# EAGLE design LCD_to_VGA_Modul (EAGLE 7.7.0)
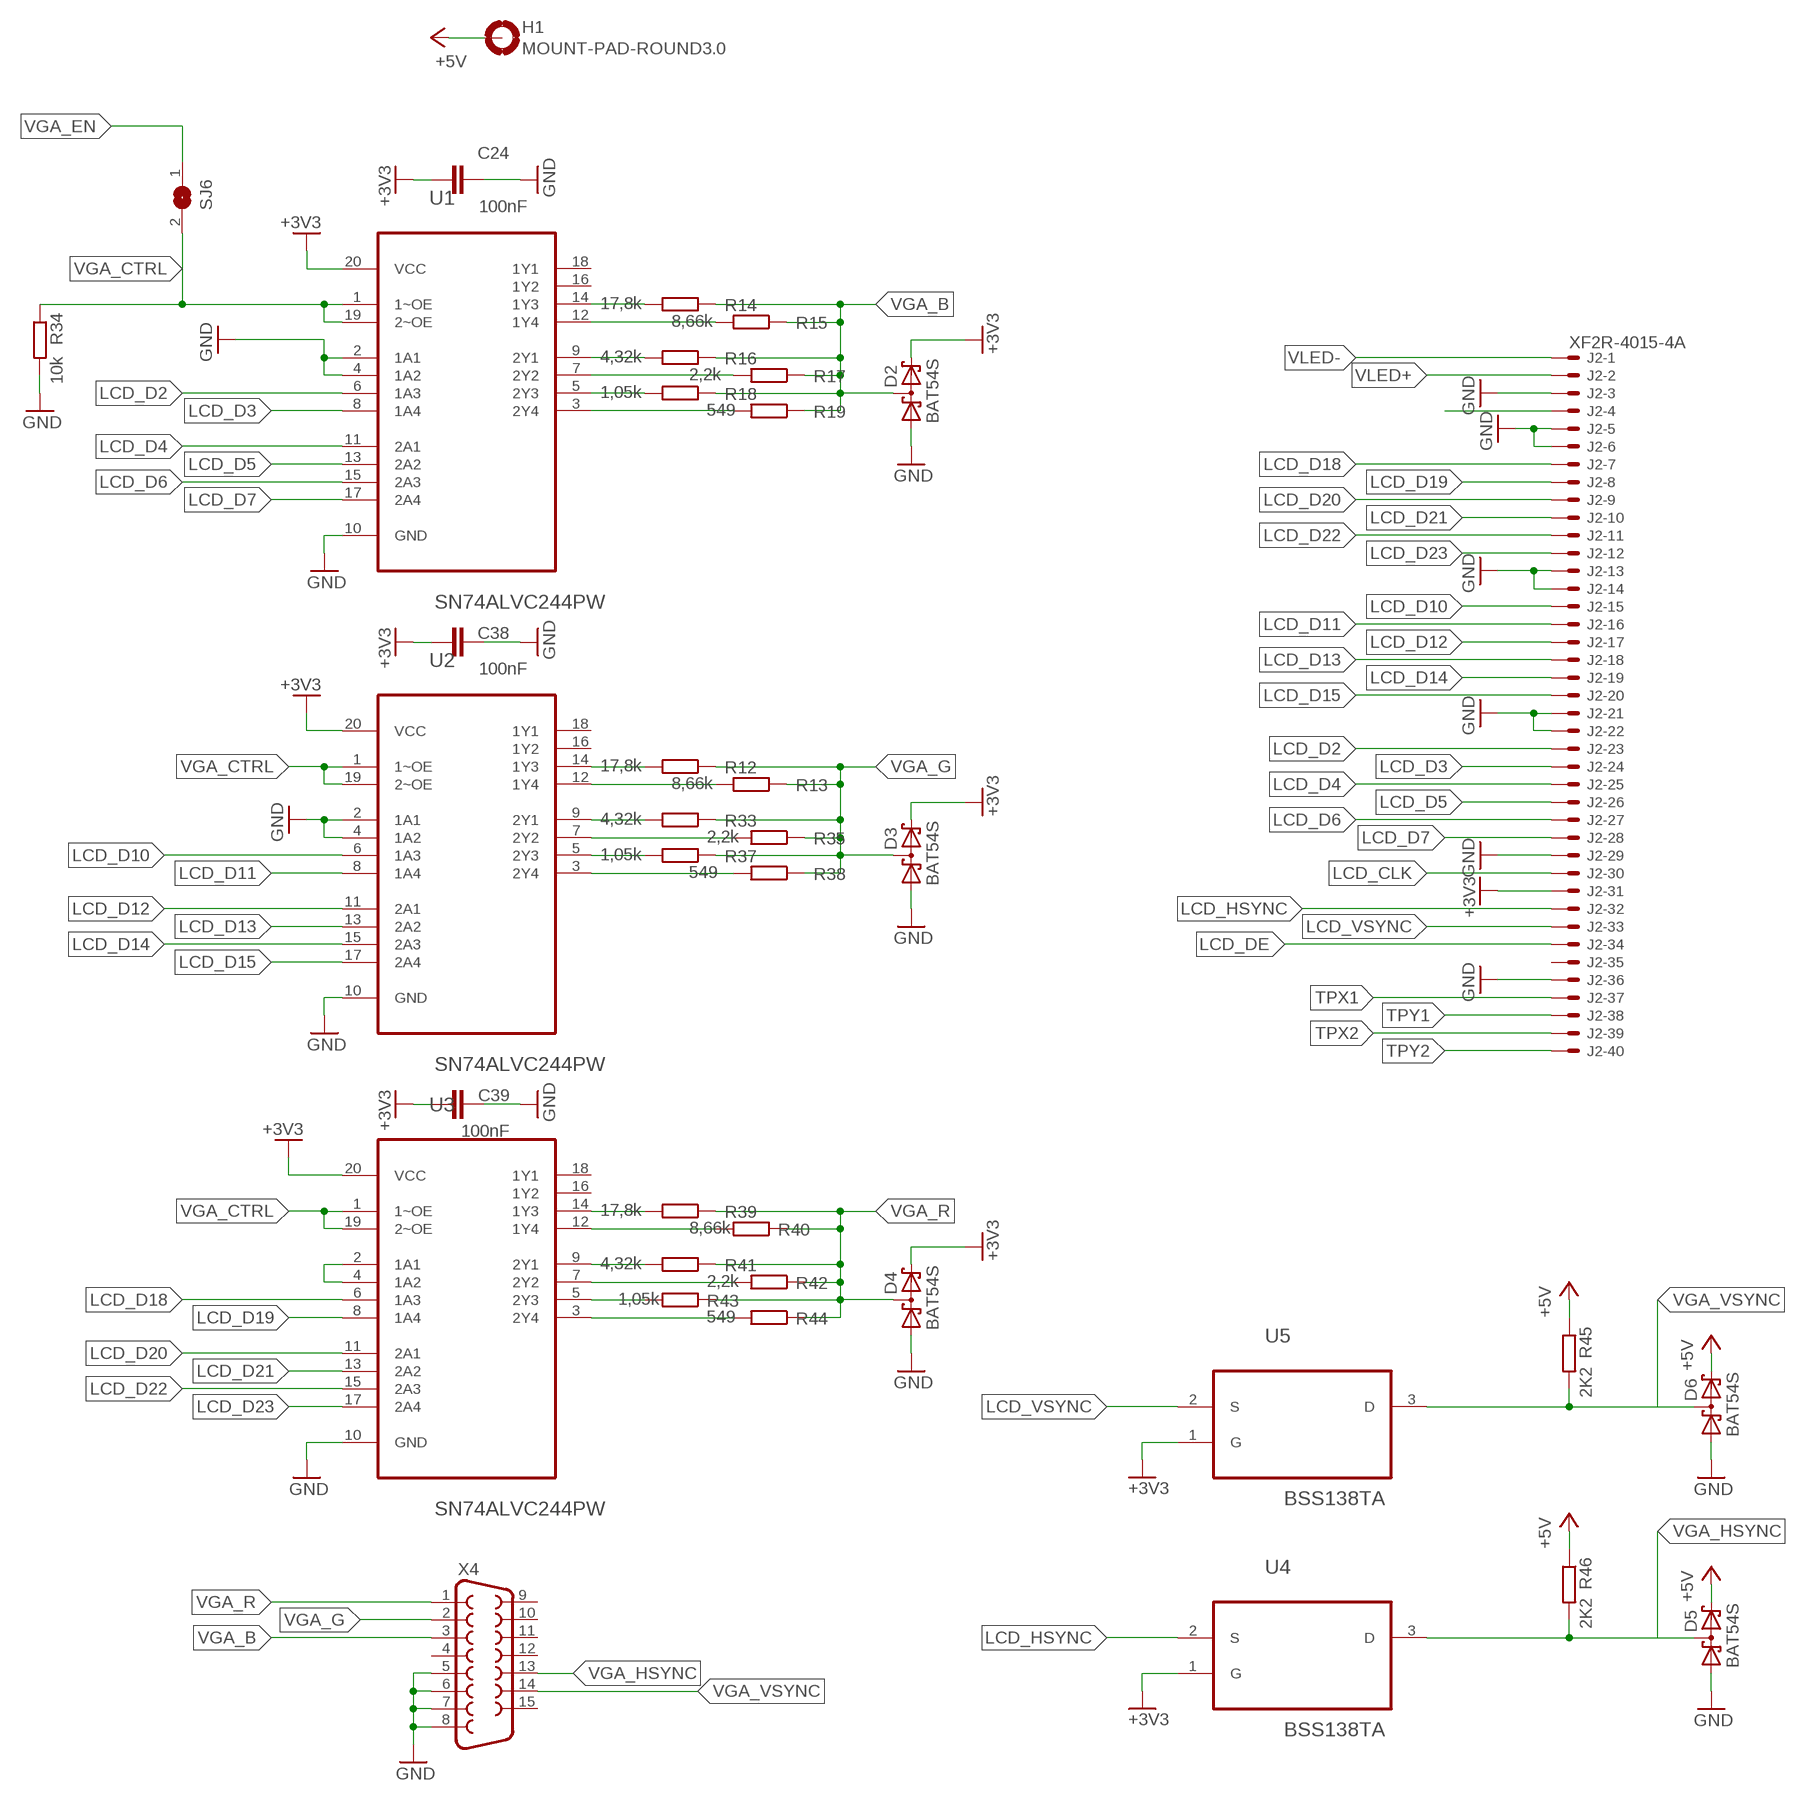
[diagram p0: schematic, sheet 1]

## Parts
C24  100nF  C-EUC0805  [C0805]
C38  100nF  C-EUC0805  [C0805]
C39  100nF  C-EUC0805  [C0805]
D2  BAT54S  [SOT23]
D3  BAT54S  [SOT23]
D4  BAT54S  [SOT23]
D5  BAT54S  [SOT23]
D6  BAT54S  [SOT23]
H1  MOUNT-PAD-ROUND3.0  [3,0-PAD]
J2  XF2R-4015-4A  [XF2R-4015-4A]
R12  17,8k  R-EU_R0805  [R0805]
R13  8,66k  R-EU_R0805  [R0805]
R14  17,8k  R-EU_R0805  [R0805]
R15  8,66k  R-EU_R0805  [R0805]
R16  4,32k  R-EU_R0805  [R0805]
R17  2,2k  R-EU_R0805  [R0805]
R18  1,05k  R-EU_R0805  [R0805]
R19  549  R-EU_R0805  [R0805]
R33  4,32k  R-EU_R0805  [R0805]
R34  10k  R-EU_R0805  [R0805]
R35  2,2k  R-EU_R0805  [R0805]
R37  1,05k  R-EU_R0805  [R0805]
R38  549  R-EU_R0805  [R0805]
R39  17,8k  R-EU_R0805  [R0805]
R40  8,66k  R-EU_R0805  [R0805]
R41  4,32k  R-EU_R0805  [R0805]
R42  2,2k  R-EU_R0805  [R0805]
R43  1,05k  R-EU_R0805  [R0805]
R44  549  R-EU_R0805  [R0805]
R45  2K2  R-EU_R0805  [R0805]
R46  2K2  R-EU_R0805  [R0805]
SJ6  SJ  [SJ]
U1  SN74ALVC244PW  [SOP65P640X120-20N]
U2  SN74ALVC244PW  [SOP65P640X120-20N]
U3  SN74ALVC244PW  [SOP65P640X120-20N]
U4  BSS138TA  [SOT95P240X110-3N]
U5  BSS138TA  [SOT95P240X110-3N]
X4  F15H  [F15H]

## Nets
+3V3: C24.2 C38.2 C39.2 D2.2(K2) D3.2(K2) D4.2(K2) J2.31 U1.20(VCC) U2.20(VCC) U3.20(VCC) U4.1(G) U5.1(G)
+5V: D5.2(K2) D6.2(K2) H1.B3,0(MOUNT) R45.1 R46.1
GND: C24.1 C38.1 C39.1 D2.1(A1) D3.1(A1) D4.1(A1) D5.1(A1) D6.1(A1) J2.3 J2.5 J2.6 J2.13 J2.14 J2.21 J2.22 J2.29 J2.36 R34.2 U1.2(1A1) U1.4(1A2) U1.10(GND) U2.2(1A1) U2.4(1A2) U2.10(GND) U3.10(GND) X4.5 X4.6 X4.7 X4.8
LCD_CLK: J2.30
LCD_D2: J2.23 U1.6(1A3)
LCD_D3: J2.24 U1.8(1A4)
LCD_D4: J2.25 U1.11(2A1)
LCD_D5: J2.26 U1.13(2A2)
LCD_D6: J2.27 U1.15(2A3)
LCD_D7: J2.28 U1.17(2A4)
LCD_D10: J2.15 U2.6(1A3)
LCD_D11: J2.16 U2.8(1A4)
LCD_D12: J2.17 U2.11(2A1)
LCD_D13: J2.18 U2.13(2A2)
LCD_D14: J2.19 U2.15(2A3)
LCD_D15: J2.20 U2.17(2A4)
LCD_D18: J2.7 U3.6(1A3)
LCD_D19: J2.8 U3.8(1A4)
LCD_D20: J2.9 U3.11(2A1)
LCD_D21: J2.10 U3.13(2A2)
LCD_D22: J2.11 U3.15(2A3)
LCD_D23: J2.12 U3.17(2A4)
LCD_DE: J2.34
LCD_HSYNC: J2.32 U4.2(S)
LCD_VSYNC: J2.33 U5.2(S)
N$1: J2.4
N$2: R12.2 U2.14(1Y3)
N$7: R13.2 U2.12(1Y4)
N$10: R14.2 U1.14(1Y3)
N$11: R15.2 U1.12(1Y4)
N$12: R16.2 U1.9(2Y1)
N$13: R17.2 U1.7(2Y2)
N$14: R18.2 U1.5(2Y3)
N$15: R19.2 U1.3(2Y4)
N$16: U3.2(1A1) U3.4(1A2)
N$26: R33.2 U2.9(2Y1)
N$27: R35.2 U2.7(2Y2)
N$28: R37.2 U2.5(2Y3)
N$29: R38.2 U2.3(2Y4)
N$30: R44.2 U3.3(2Y4)
N$31: R43.2 U3.5(2Y3)
N$32: R42.2 U3.7(2Y2)
N$33: R41.2 U3.9(2Y1)
N$34: R40.2 U3.12(1Y4)
N$35: R39.2 U3.14(1Y3)
TPX1: J2.37
TPX2: J2.39
TPY1: J2.38
TPY2: J2.40
VGA_B: D2.3(K1A2) R14.1 R15.1 R16.1 R17.1 R18.1 R19.1 X4.3
VGA_CTRL: R34.1 SJ6.2 U1.1(1~OE) U1.19(2~OE) U2.1(1~OE) U2.19(2~OE) U3.1(1~OE) U3.19(2~OE)
VGA_EN: SJ6.1
VGA_G: D3.3(K1A2) R12.1 R13.1 R33.1 R35.1 R37.1 R38.1 X4.2
VGA_HSYNC: D5.3(K1A2) R46.2 U4.3(D) X4.13
VGA_R: D4.3(K1A2) R39.1 R40.1 R41.1 R42.1 R43.1 R44.1 X4.1
VGA_VSYNC: D6.3(K1A2) R45.2 U5.3(D) X4.14
VLED+: J2.2
VLED-: J2.1
Unconnected: J2.35 U1.16(1Y2) U1.18(1Y1) U2.16(1Y2) U2.18(1Y1) U3.16(1Y2) U3.18(1Y1) X4.4 X4.9 X4.10 X4.11 X4.12 X4.15

## Library data of the parts
C24 C38 C39 = rcl:C-EU: CAPACITOR, European symbol
D2-D6 = nxp_60:BAT54S: Schottky barrier (double) diodes Planar Schottky barrier diodes encapsulated in a SOT23 small plastic SMD package. Single diodes and double diodes with different pinning are available. AAL Eindhoven MK
H1 = holes:MOUNT-PAD-ROUND: MOUNTING PAD, round
J2 = con-omron:XF2*-40?: OMRON FPC Connector Source : http://www.omron.com/ecb/products/pdf/fpc.pdf
R12-R19 R33-R35 R37-R46 = rcl:R-EU_: RESISTOR, European symbol
SJ6 = jumper:SJ: SMD solder JUMPER
U1-U3 = Texas Instruments_By_element14_Batch_1:SN74ALVC244PW: OCTAL BUFFERS/DRIVERS WITH 3-STATE OUTPUTS; MPN: SN74ALVC244PW; OC_FARNELL: 1470750; OC_NEWARK: 36K3549; PACKAGE: TSSOP-20; SUPPLIER: Texas Instruments
U4 U5 = Diodes_Inc_By_element14_Batch_1:BSS138TA: N-CHANNEL ENHANCEMENT MODE MOSFET; MPN: BSS138TA; OC_FARNELL: 1471176; OC_NEWARK: 61M5072; PACKAGE: SOT-23-3; SUPPLIER: Diodes Inc
X4 = adafruit:F15: SUB-D HDH is also known as a 'right angle VGA' connector

## Net classes
0 default: clearance 0.152 mm

## Board
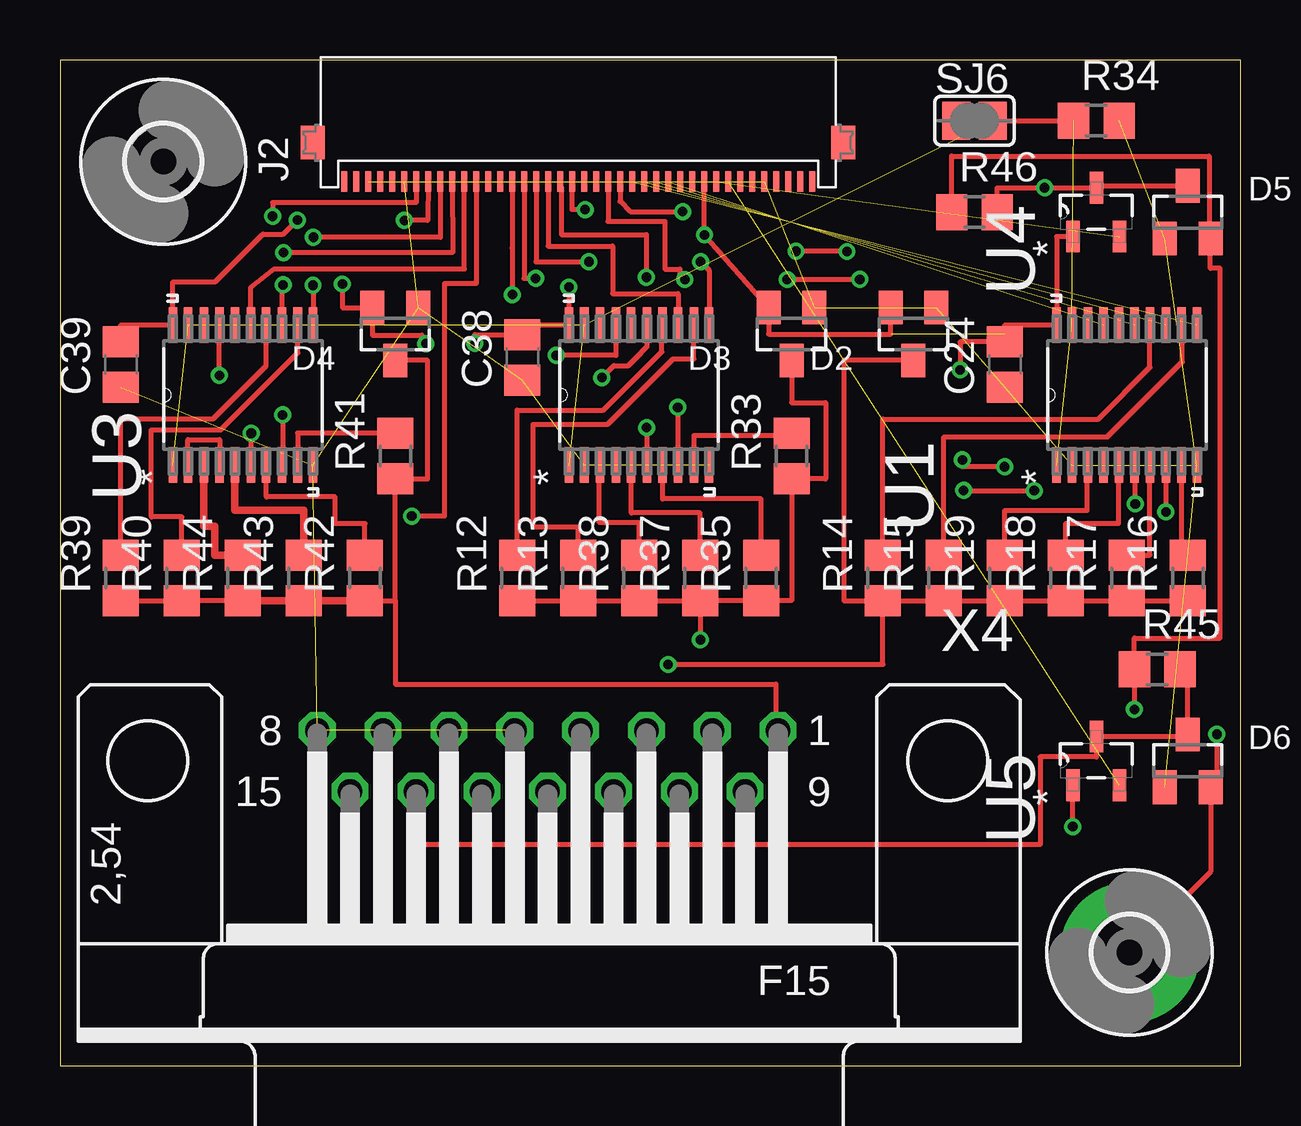
[diagram p1: board, top side]
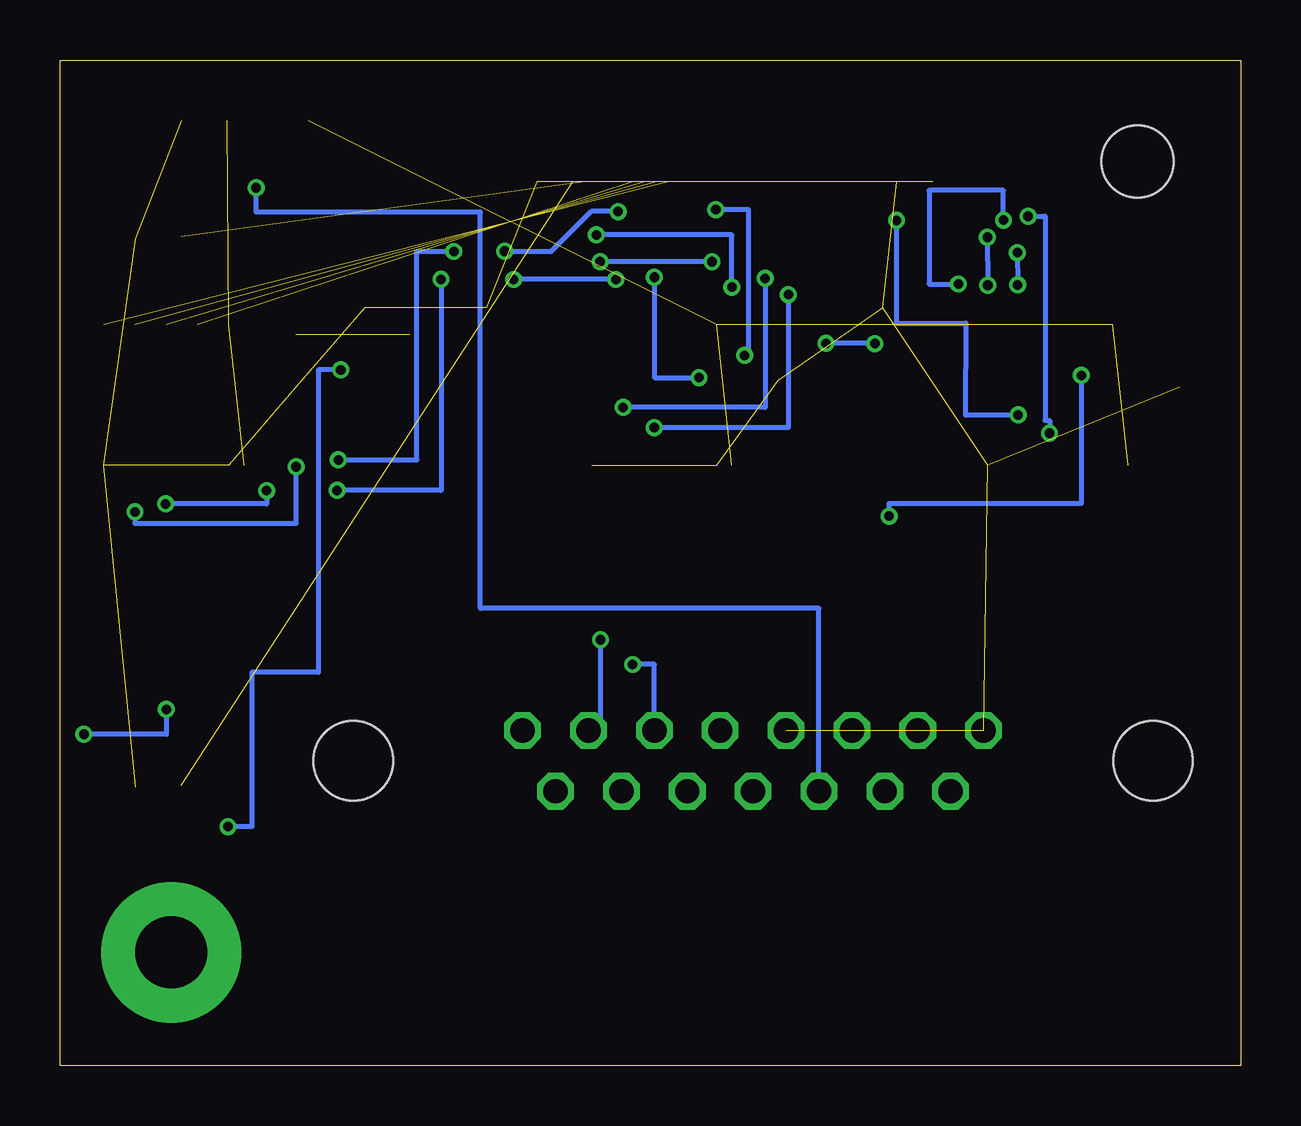
[diagram p2: board, bottom side, seen from below]

Size 49.2 x 41.9 mm. Coordinates in mm from the lower left corner, seen from the top.
Outline: 0,0 49.2,0 49.2,41.9 0,41.9 0,0
Copper layers (1*16): Top 0.035mm / dielectric 1.5mm / Bottom 0.035mm
Design rules "SeeedStudio_2layer_DRU_no_angle_20140221": minimum track width 6mil, minimum drill 12mil, track to track 6mil, track to pad 6mil, pad to pad 6mil, via to via 6mil, smd to smd 0mil, copper to edge 10mil, drill to drill 10mil, minimum pad ring 10mil, minimum via ring 6mil, stop-mask expansion 2mil, vias tented up to drill 100mil, thermal gap 10mil

### Footprints (pad centres in the part's own frame; a part is rotated, then mirrored left to right if it is on the bottom)
C0805 = smd 1.3 x 1.5: 1 -0.95,0; 2 0.95,0
SOT23 = smd 1 x 1.4: 1 -0.95,-1.1; 2 0.95,-1.1; 3 0,1.1
3,0-PAD = drill 3 pad 5.842: B3,0 0,0
XF2R-4015-4A = smd 0.85 x 0.25: 1 -2.54,9.75; 2 -2.54,9.25; 3 -2.54,8.75; 4 -2.54,8.25; 5 -2.54,7.75; 6 -2.54,7.25; 7 -2.54,6.75; 8 -2.54,6.25; 9 -2.54,5.75; 10 -2.54,5.25; 11 -2.54,4.75; 12 -2.54,4.25; 13 -2.54,3.75; 14 -2.54,3.25; 15 -2.54,2.75; 16 -2.54,2.25; 17 -2.54,1.75; 18 -2.54,1.25; 19 -2.54,0.75; 20 -2.54,0.25; 21 -2.54,-0.25; 22 -2.54,-0.75; 23 -2.54,-1.25; 24 -2.54,-1.75; 25 -2.54,-2.25; 26 -2.54,-2.75; 27 -2.54,-3.25; 28 -2.54,-3.75; 29 -2.54,-4.25; 30 -2.54,-4.75; 31 -2.54,-5.25; 32 -2.54,-5.75; 33 -2.54,-6.25; 34 -2.54,-6.75; 35 -2.54,-7.25; 36 -2.54,-7.75; 37 -2.54,-8.25; 38 -2.54,-8.75; 39 -2.54,-9.25; 40 -2.54,-9.75 | smd 1.4 x 1: M1 -0.915,11.05; M2 -0.915,-11.05
R0805 = smd 1.3 x 1.5: 1 -0.95,0; 2 0.95,0
SJ = smd 1.168 x 1.6: 1 -0.762,0; 2 0.762,0
SOP65P640X120-20N = smd 1.473 x 0.356: 1 -2.921,2.921; 2 -2.921,2.286; 3 -2.921,1.626; 4 -2.921,0.965; 5 -2.921,0.33; 6 -2.921,-0.33; 7 -2.921,-0.965; 8 -2.921,-1.626; 9 -2.921,-2.286; 10 -2.921,-2.921; 11 2.921,-2.921; 12 2.921,-2.286; 13 2.921,-1.626; 14 2.921,-0.965; 15 2.921,-0.33; 16 2.921,0.33; 17 2.921,0.965; 18 2.921,1.626; 19 2.921,2.286; 20 2.921,2.921
SOT95P240X110-3N = smd 1.321 x 0.559: 1 -1.016,0.965; 2 -1.016,-0.965; 3 1.016,0
3,0 = hole 3: 0,0
F15H = drill 1.016 octagon: 1 -9.601,-1.27; 2 -6.858,-1.27; 3 -4.115,-1.27; 4 -1.372,-1.27; 5 1.372,-1.27; 6 4.115,-1.27; 7 6.858,-1.27; 8 9.601,-1.27; 9 -8.23,1.27; 10 -5.486,1.27; 11 -2.743,1.27; 12 0,1.27; 13 2.743,1.27; 14 5.486,1.27; 15 8.23,1.27 | hole 3.302: -16.662,0; 16.662,0

### Placement (x,y rotation side)
C24  39.37,29.21 90 top
C38  19.27,29.51 90 top
C39  2.54,29.21 90 top
D2  35.56,30.48 180 top
D3  30.48,30.48 180 top
D4  13.97,30.48 180 top
D5  46.99,35.56 0 top
D6  46.99,12.7 0 top
H1  44.57,4.71 0 top
J2  21.59,39.37 90 top
R12  19.05,20.32 90 top
R13  21.59,20.32 90 top
R14  34.29,20.32 90 top
R15  36.83,20.32 90 top
R16  46.99,20.32 90 top
R17  44.45,20.32 90 top
R18  41.91,20.32 90 top
R19  39.37,20.32 90 top
R33  30.48,25.4 90 top
R34  43.18,39.37 0 top
R35  29.21,20.32 90 top
R37  26.67,20.32 90 top
R38  24.13,20.32 90 top
R39  2.54,20.32 90 top
R40  5.08,20.32 90 top
R41  13.97,25.4 90 top
R42  12.7,20.32 90 top
R43  10.16,20.32 90 top
R44  7.62,20.32 90 top
R45  45.72,16.51 0 top
R46  38.1,35.56 0 top
SJ6  38.1,39.37 0 top
U1  44.45,27.94 90 top
U2  24.13,27.94 90 top
U3  7.62,27.94 90 top
U4  43.18,35.56 90 top
U5  43.18,12.7 90 top
U$3  [3,0]  4.3,37.67 0 top
X4  20.32,12.7 180 top

### Tracks (layer width: path | path; a pad name or v marks a point on that pad's centre or on a via)
+3V3  (via drill 0.4)  (1 unrouted)
  Top 0.203: C39.2 2.54,30.86 U3.20 4.7,32.65 6.46,32.65 8.46,34.65 9.31,34.65 v9.89,35.23 | D4.2 13.02,32.05 | D4.2 13.02,30.44 15.09,30.44 15.09,30.09 v15.24,30.09 | v21.21,32.44 U2.20 19.27,30.86 C38.2 17.29,30.46 v17.29,30.09 | J2.31 26.85,36.83 v26.85,34.61 D3.2 29.53,30.48 34.62,30.48 D2.2 | v11.77,32.57 11.77,31.58 D4.2 | U4.1 41.53,34.54 U1.20 39.37,30.86 C24.2 | C24.2 39.37,30.48 | C24.2 37.5,30.16 v37.5,28.99 | v42.2,9.96 42.2,11.68 U5.1
  Bottom 0.203: v15.24,30.09 v17.29,30.09 | v21.21,32.44 21.21,34.61 v26.85,34.61 | v9.89,35.23 9.89,36.47 12.99,36.47 12.99,32.57 v11.77,32.57 | v37.5,28.99 38.43,28.99 38.43,16.39 41.21,16.39 41.21,9.96 v42.2,9.96
+5V  (via drill 0.4)
  Top 0.203: H1.B3,0 47.94,8.09 D6.2 48.2,11.6 v48.2,13.81 | v44.77,14.85 R45.1 44.77,17.81 48.34,17.81 48.34,33.21 47.93,33.21 D5.2 47.88,34.46 47.88,37.89 37.15,37.89 R46.1
  Bottom 0.203: v44.77,14.85 44.77,13.81 v48.2,13.81
GND  (28 unrouted)
LCD_D2  (via drill 0.4)
  Top 0.203: J2.23 22.84,35.18 25.2,35.18 25.2,33.19 25.82,33.19 25.82,32.75 v26.04,32.75 | v30.3,32.76 v33.32,32.76 | v37.65,23.97 37.41,23.96 v40.59,23.96 | v44.8,23.41 44.8,25 arc90 U1.6
  Bottom 0.203: v26.04,32.75 v26.04,32.76 v30.3,32.76 | v33.32,32.76 33.32,23.97 v37.65,23.97 | v40.59,23.96 40.59,23.41 v44.8,23.41
LCD_D3  (via drill 0.4)
  Top 0.203: U1.8 v46.08,23.07 | v39.36,24.95 37.6,24.95 v37.6,25.24 | v32.79,33.92 v32.79,33.93 v30.67,33.93 | J2.24 23.34,36.01 23.76,35.58 v25.94,35.58
  Bottom 0.203: v46.08,23.07 46.08,22.59 39.36,22.59 v39.36,24.95 | v37.6,25.24 34.34,25.24 34.34,33.92 v32.79,33.92 | v30.67,33.93 28.73,33.93 27.06,35.59 25.96,35.59 v25.94,35.58
LCD_D4  (1 unrouted)
LCD_D5  (1 unrouted)
LCD_D6  (1 unrouted)
LCD_D7  (1 unrouted)
LCD_D10  (via drill 0.4)
  Top 0.203: J2.15 18.84,34.06 v18.85,32.12 | v24.44,26.58 24.44,25.02 U2.6
  Bottom 0.203: v18.85,32.12 18.85,26.58 v24.44,26.58
LCD_D11  (via drill 0.4)
  Top 0.203: J2.16 19.34,32.8 v19.82,32.8 | v25.74,27.43 25.74,25.02 U2.8
  Bottom 0.203: v19.82,32.8 19.82,27.43 v25.74,27.43
LCD_D12  (via drill 0.4)
  Top 0.203: J2.17 19.84,33.5 | 19.84,33.49 19.84,33.5 | 19.84,33.5 v22.03,33.5 | v26.7,33.49 27.05,33.14 U2.11
  Bottom 0.203: v22.03,33.5 v22.03,33.49 v26.7,33.49
LCD_D13
  Top 0.203: U2.13 25.75,32.16 23.03,32.16 23.02,34.15 20.34,34.15 J2.18
LCD_D14  (via drill 0.4)
  Top 0.203: J2.19 20.84,36.59 20.89,36.59 20.89,34.62 24.43,34.62 24.43,33.48 24.44,33.48 v24.44,32.85 | U2.15 24.46,29.97 24.24,29.75 24.24,29.72 23.68,29.16 23.07,29.16 v22.58,28.66
  Bottom 0.203: v24.44,32.85 24.44,28.66 v22.58,28.66
LCD_D15  (via drill 0.4)
  Top 0.203: U2.17 23.16,29.59 v20.68,29.59 | v21.88,35.66 21.34,35.66 J2.20
  Bottom 0.203: v20.68,29.59 20.51,29.59 20.51,35.66 v21.88,35.66
LCD_D18  (via drill 0.4)
  Top 0.203: J2.7 14.84,35.96 8.86,35.96 v8.86,35.39 | v7.97,26.35 7.95,26.35 U3.6
  Bottom 0.203: v8.86,35.39 8.15,35.39 8.15,26.88 7.97,26.88 v7.97,26.35
LCD_D19  (via drill 0.4)
  Top 0.203: J2.8 15.32,35.22 v14.35,35.22 | v9.28,27.12 9.28,25.02 U3.8
  Bottom 0.203: v14.35,35.22 14.35,30.93 11.46,30.93 11.48,27.12 v9.28,27.12
LCD_D20  (via drill 0.4)
  Top 0.203: J2.9 15.85,34.51 v10.56,34.51 | v10.54,32.51 U3.11
  Bottom 0.203: v10.56,34.51 v10.55,32.51 v10.54,32.51
LCD_D21  (via drill 0.4)
  Top 0.203: J2.10 16.36,33.88 v9.31,33.88 | v9.3,32.53 arc90 9.25,32.48 U3.13
  Bottom 0.203: v9.31,33.88 v9.29,32.53 v9.3,32.53
LCD_D22
  Top 0.203: U3.15 7.95,32.42 8.93,33.2 16.85,33.2 J2.11
LCD_D23  (via drill 0.4)
  Top 0.203: J2.12 17.34,32.58 16.02,32.58 16.02,22.89 v14.65,22.89 | v6.64,28.76 U3.17
  Bottom 0.203: v14.65,22.89 14.65,23.43 6.63,23.43 6.63,28.76 v6.64,28.76
LCD_HSYNC  (1 unrouted)
LCD_VSYNC  (1 unrouted)
N$2
  Top 0.203: R12.2 19.05,27.31 22.64,27.31 25.07,29.74 25.07,30.84 U2.14
N$7
  Top 0.203: R13.2 21.59,22.44 19.72,22.44 19.72,26.72 22.82,26.72 25.54,29.44 26.42,29.44 U2.12
N$10
  Top 0.203: R14.2 34.29,26.94 43.26,26.94 45.41,29.09 U1.14
N$11
  Top 0.203: R15.2 36.83,26.2 43.64,26.2 46.76,29.32 46.76,30.84 U1.12
N$12
  Top 0.203: R16.2 arc-90 46.74,21.52 U1.9
N$13
  Top 0.203: R17.2 45.41,21.27 U1.7
N$14
  Top 0.203: R18.2 41.91,22.6 44.11,22.6 44.11,25.02 U1.5
N$15
  Top 0.203: R19.2 39.37,23.14 42.8,23.14 42.8,25.02 U1.3
N$16
  Top 0.203: U3.2 5.33,26.08 6.65,26.08 U3.4
N$26
  Top 0.203: R33.2 30.48,26.25 26.42,26.25 U2.9
N$27
  Top 0.203: R35.2 29.21,23.62 25.11,23.62 U2.7
N$28
  Top 0.203: R37.2 26.67,23.03 23.8,23.03 U2.5
N$29
  Top 0.203: R38.2 24.13,22.62 22.47,22.62 22.47,25.02 U2.3
N$30
  Top 0.305: R44.2 6.45,21.27 6.45,22.47 5.99,22.47 U3.3
N$31
  Top 0.305: R43.2 10.16,23.14 7.29,23.14 U3.5
N$32
  Top 0.203: R42.2 12.7,22.59 11.47,22.59 11.47,23.7 8.6,23.7 U3.7
  Top 0.305: U3.7
N$33
  Top 0.203: R41.2 9.91,26.35 U3.9
N$34
  Top 0.203: 9.97,30.86 U3.12 9.91,29.7 6.7,26.49 3.81,26.49 3.81,22.86 5.08,22.86 R40.2
N$35
  Top 0.203: R39.2 2.54,26.96 6.39,26.96 8.59,29.16 U3.14
VGA_B  (via drill 0.4)
  Top 0.203: D2.3 32.67,29.38 32.67,19.37 R14.1 | R16.1 R17.1 R18.1 41.91,19.33 41.33,19.33 41.33,19.37 R19.1 R15.1 R14.1 | R14.1 | v25.34,16.71 34.29,16.71 R14.1
  Bottom 0.203: X4.3 24.43,16.71 v25.34,16.71
VGA_CTRL  (6 unrouted)
  Top 0.203: SJ6.2 R34.1
VGA_G  (via drill 0.4)
  Top 0.203: D3.3 30.48,27.62 31.9,27.62 31.9,24.45 R33.1 30.48,19.37 R35.1 R37.1 | R37.1 R38.1 R13.1 R12.1 | R37.1 v26.67,17.74 v26.68,17.74
  Bottom 0.203: v26.68,17.74 26.68,13.97 X4.2
VGA_HSYNC  (via drill 0.4)
  Top 0.203: R46.2 39.05,36.58 40.68,36.58 v41.03,36.58 U4.3 43.18,36.66 D5.3
  Bottom 0.203: X4.13 17.58,19.05 31.69,19.05 31.69,35.56 41.03,35.56 v41.03,36.58
VGA_R
  Top 0.203: R42.1 13.97,19.37 | 13.97,19.37 R41.1 15.31,24.45 15.31,29.38 D4.3 | R39.1 R40.1 R44.1 | 13.97,19.37 13.97,15.89 29.83,15.89 29.83,13.97 X4.1
  Top 0.305: R44.1 R43.1 R42.1
VGA_VSYNC
  Top 0.203: R45.2 46.99,16.19 D6.3 46.91,13.72 U5.3 43.18,12.86 40.84,12.86 40.84,9.21 14.83,9.21 X4.14